# Altium schematic sheet OpenPack_BATMOD_V2p0_USBA.SchDoc
size A4; SheetNumber: 8; SheetTotal: 9; Title_: USB A Port
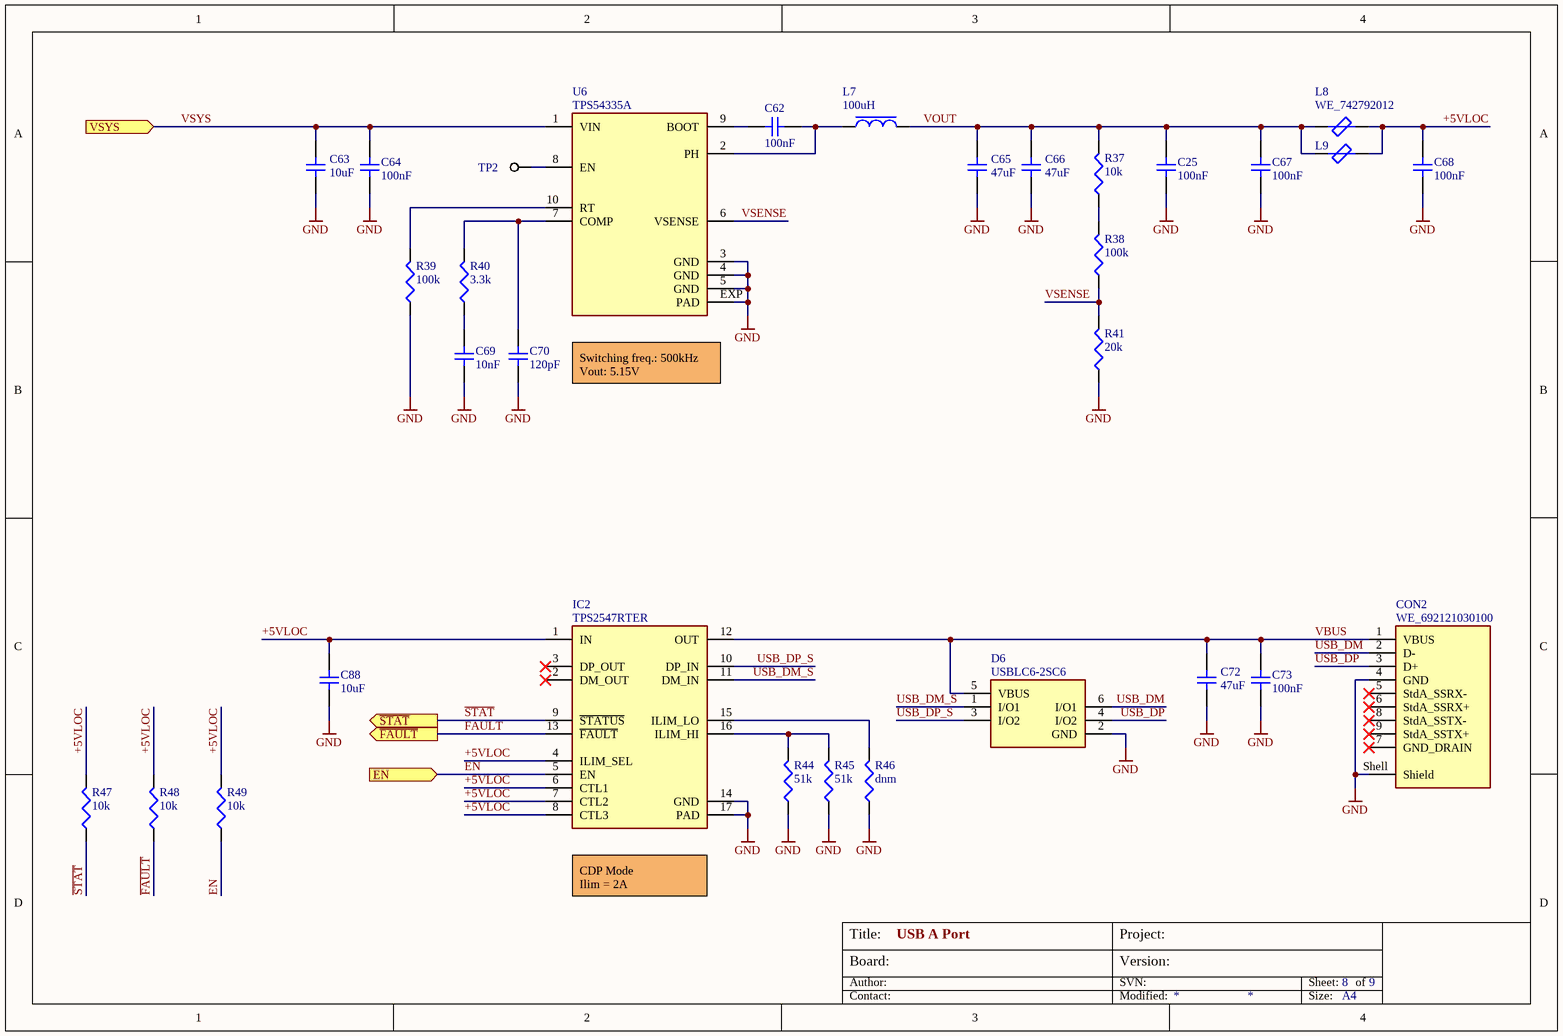
[diagram p0: OpenPack_BATMOD_V2p0_USBA.SchDoc]

## Parts
C25  100nF  [CAP_0603]
C62  100nF  [CAP_0603]
C63  10uF  [CAP_1210]
C64  100nF  [CAP_0603]
C65  47uF  [CAP_1210]
C66  47uF  [CAP_1210]
C67  100nF  [CAP_0603]
C68  100nF  [CAP_0603]
C69  10nF  [CAP_0603]
C70  120pF  [CAP_0603]
C72  47uF  [CAP_1210]
C73  100nF  [CAP_0603]
C88  10uF  [CAP_0603]
CON2  WE_692121030100  [WE_692121030100]
D6  USBLC6-2SC6  [SOT-23-6]
IC2  TPS2547RTER  [QFN-16]
L7  100uH  [IND_2]
L8  WE_742792012  [IND-0805]
L9  WE_742792012  [IND-0805]  (value not drawn)
R37  10k  [RES-0603]
R38  100k  [RES-0603]
R39  100k  [RES-0603]
R40  3.3k  [RES-0603]
R41  20k  [RES-0603]
R44  51k  [RES-0603]
R45  51k  [RES-0603]
R46  dnm  [RES-0603]
R47  10k  [RES-0603]
R48  10k  [RES-0603]
R49  10k  [RES-0603]
TP2  TESTPOINT  [TESTPOINT1MM]  (value not drawn)  (no BOM)
U6  TPS54335A  [VSON-10]

## Ports
EN (in, see OpenPack_BATMOD_V2p0_MAIN), VSYS (in, see OpenPack_BATMOD_V2p0_MAIN, OpenPack_BATMOD_V2p0_CHRG, OpenPack_BATMOD_V2p0_PWR), ~{FAULT} (out, see OpenPack_BATMOD_V2p0_MAIN), ~{STAT} (out, see OpenPack_BATMOD_V2p0_MAIN)

## Nets
GND: C25.2 C63.1 C64.2 C65.1 C66.1 C67.2 C68.2 C69.2 C70.2 C72.1 C73.2 C88.1 CON2.4(GND) CON2.Shell(Shield) D6.2(GND) IC2.14(GND) IC2.17(PAD) R39.1 R41.1 R44.1 R45.1 R46.1 U6.3(GND) U6.4(GND) U6.5(GND) U6.EXP(PAD)
+5VLOC: C68.1 C88.2 IC2.1(IN) IC2.4(ILIM_SEL) IC2.6(CTL1) IC2.7(CTL2) IC2.8(CTL3) L8.2 L9.2 R47.2 R48.2 R49.2
EN: IC2.5(EN) R49.1 ; port EN
~{FAULT}: IC2.13(~{FAULT}) R48.1 ; port ~{FAULT}
~{STAT}: IC2.9(~{STATUS}) R47.1 ; port ~{STAT}
USB_DM: CON2.2(D-) D6.6(I/O1)
USB_DM_S: D6.1(I/O1) IC2.11(DM_IN)
USB_DP: CON2.3(D+) D6.4(I/O2)
USB_DP_S: D6.3(I/O2) IC2.10(DP_IN)
VBUS: C72.2 C73.1 CON2.1(VBUS) D6.5(VBUS) IC2.12(OUT)
VOUT: C25.1 C65.2 C66.2 C67.1 L7.2 L8.1 L9.1 R37.2
VSENSE: R38.1 R41.2 U6.6(VSENSE)
VSYS: C63.2 C64.1 U6.1(VIN) ; port VSYS
NetC62_1: C62.1 L7.1 U6.2(PH)
NetC62_2: C62.2 U6.9(BOOT)
NetC69_1: C69.1 R40.1
NetC70_1: C70.1 R40.2 U6.7(COMP)
NetIC2_15: IC2.15(ILIM_LO) R46.2
NetIC2_16: IC2.16(ILIM_HI) R44.2 R45.2
NetR37_1: R37.1 R38.2
NetR39_2: R39.2 U6.10(RT)
NetTP2_0: TP2.0 U6.8(EN)

Not connected (* = marked no-connect by the designer): CON2 5(StdA_SSRX-)* 6(StdA_SSRX+)* 7(GND_DRAIN)* 8(StdA_SSTX-)* 9(StdA_SSTX+)*; IC2 2(DM_OUT)* 3(DP_OUT)*

## Notes on the sheet
- Switching freq.: 500kHz
  Vout: 5.15V
- (near IC2) CDP Mode
  Ilim = 2A
- Board:
- Author:
- Title:
- Project:
- SVN:
- Version:
- Sheet:
- of
- Contact:
- Modified:
- Size:
- A4

## Library data of the parts
C25 C62 C64 C67-C70 C73 C88 = NP-CAPACITOR: MLCC capacitor; Type: CAP
C63 = NP-CAPACITOR: UMK325BJ106KM-P; Part number: 810-CGA6P1X7R1N106K2; Type: CAP; Supplier: Mouser
C65 C66 C72 = NP-CAPACITOR: Np-Cap; Part number: 80-C1210C476M4P; Type: CAP; Supplier: Mouser
CON2 = WE_692121030100: USB Connectors WR-COM 3.0 TypeA SMT 9Pin Horztl Female; Part number: 710-692121030100; ComponentLink1Description: Datasheet; Supplier: Mouser; ComponentLink2Description: Order; ComponentLink2URL: https://hu.mouser.com/en/ProductDetail/Wurth-Elektronik/692121030100?qs=e5m3IbTHPW%252BzU%252B9ZpCsp%2Fg%3D%3D; Type: IC
D6 = USBLC6-2SC6: ESD Protection Diodes / TVS Diodes ESD Protection Low Cap; Part number: 511-USBLC6-2SC6; Type: Diode; Supplier: Mouser; ComponentLink1Description: Datasheet; ComponentLink2Description: Order; ComponentLink2URL: https://hu.mouser.com/en/ProductDetail/STMicroelectronics/USBLC6-2SC6?qs=po45yt2pPpu%2FhNIlwQdTlg%3D%3D
IC2 = TPS2547RTER: USB Switch ICs USB charging port co ntroller and 3A pow A 595-TPS2547RTET; Part number: 595-TPS2547RTER; Supplier: Mouser; Type: IC; ComponentLink1Description: Datasheet; ComponentLink2Description: Order; ComponentLink2URL: https://hu.mouser.com/en/ProductDetail/Texas-Instruments/TPS2547RTER?qs=sGAEpiMZZMutXGli8Ay4kLXLEI0dbCtTlAK%2FeCGBCiY%3D
L7 = Inductance - 22uH: Ferrit core coil, 22uH 2.85A, 75mR; Part number: 994-MSS1038T-223MLC; Type: IND; Supplier: Mouser; ComponentLink1Description: Datasheet; ComponentLink2Description: Order; ComponentLink2URL: https://hu.mouser.com/en/ProductDetail/Coilcraft/MSS1038T-223MLC?qs=zCSbvcPd3pYngswiQ3YHhA%3D%3D
L8 L9 = WE_742792012: Chip Ferrite Bead, 33R @100MHz, 4A; Part number: 710-742792012; Type: IND; Supplier: Mouser; ComponentLink1Description: Datasheet; ComponentLink2Description: Order; ComponentLink2URL: https://hu.mouser.com/en/ProductDetail/Wurth-Elektronik/742792012?qs=J4sk5G6CMwb1B4GP%2Fe%2FxmA%3D%3D
R37-R41 R44-R49 = RESISTOR: Metal Film Resistor; Type: RES
TP2 = TESTPOINT: SMD testpoint
U6 = TPS54335A: Switching Voltage Regulators 4.5Vto28VInp 3A Sync Step-Down Converter A 595-TPS54335ADRCT; Part number: 595-TPS54335ADRCR; Supplier: Mouser; ComponentLink1Description: Datasheet; ComponentLink2Description: Order; ComponentLink2URL: https://hu.mouser.com/en/ProductDetail/Texas-Instruments/TPS54335ADRCR?qs=ADSrZYdIRCdK%252Bcxbafh6hw%3D%3D; Type: PWR-REG